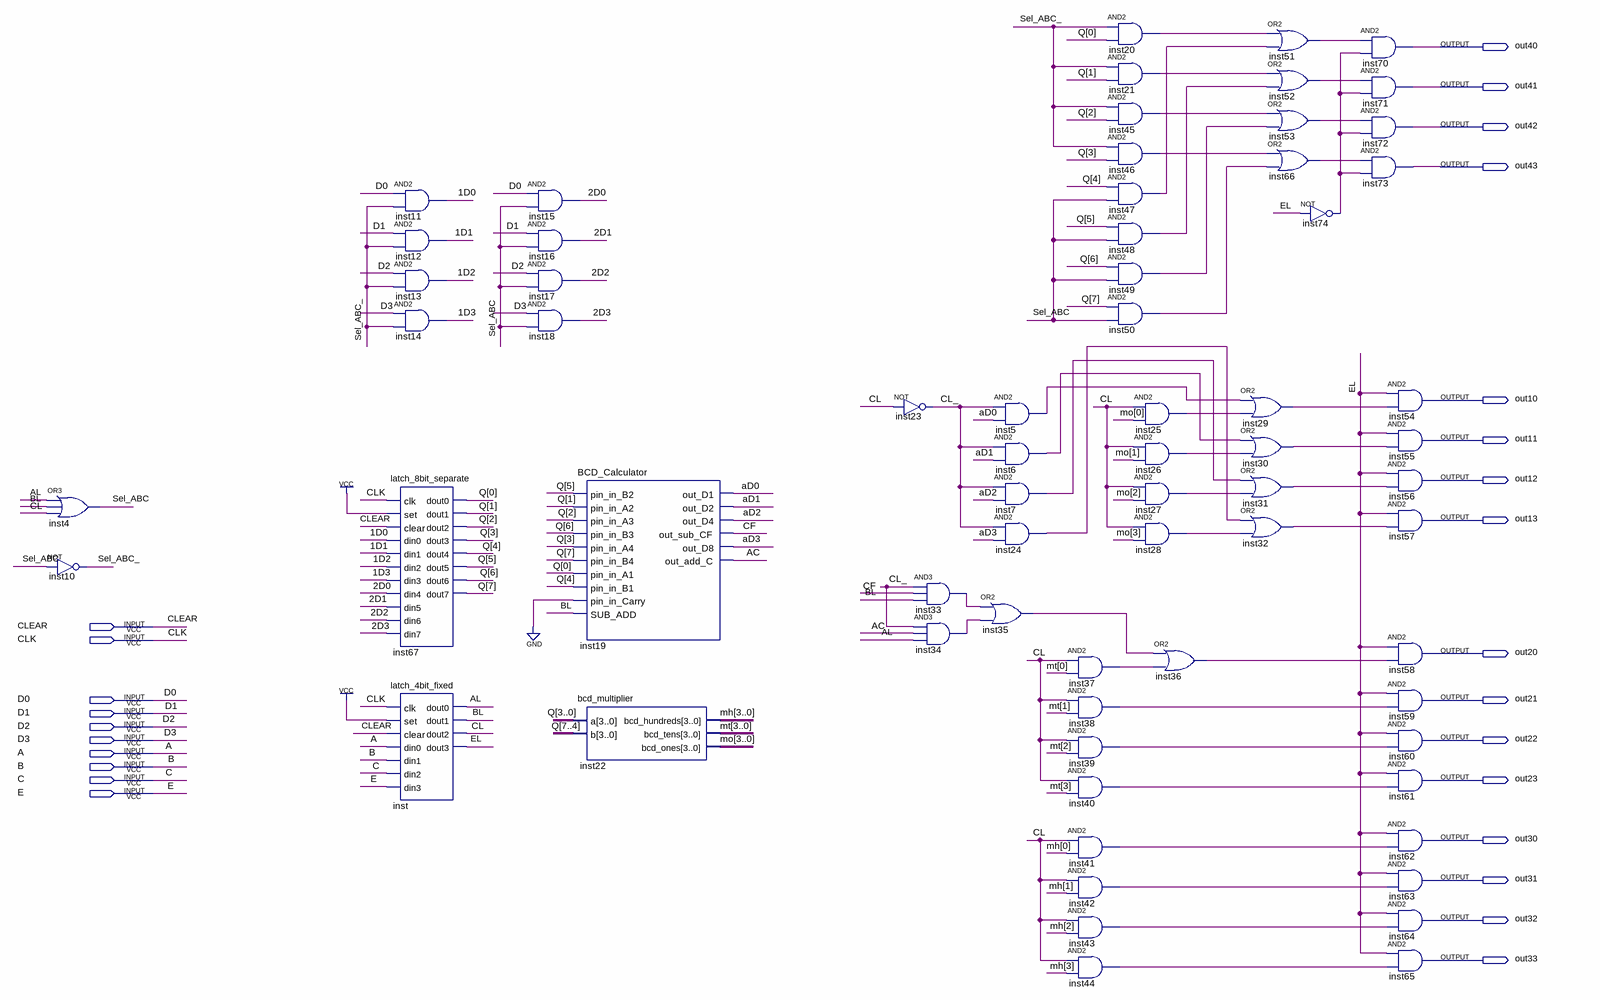
[diagram p0: schematic sheet]
// Quartus schematic Simulation_Circuit.bdf as structural Verilog: 68 symbols, 26 pins
module Simulation_Circuit (
  input  CLEAR,
  input  CLK,
  input  D0,
  input  D1,
  input  D2,
  input  D3,
  input  A,
  input  B,
  input  C,
  input  E,
  output out40,
  output out41,
  output out42,
  output out43,
  output out10,
  output out11,
  output out12,
  output out13,
  output out20,
  output out21,
  output out22,
  output out23,
  output out30,
  output out31,
  output out32,
  output out33
);

  wire \1D0 , \1D1 , \1D2 , \1D3 , \2D0 , \2D1 , \2D2 , \2D3 , AC, aD0, aD1, aD2, aD3, AL, BL, CF, CL, CL_,
       EL, inst5_out, inst6_out, inst7_out, inst20_out, inst21_out, inst24_out, inst25_out, inst26_out,
       inst27_out, inst28_out, inst29_out, inst30_out, inst31_out, inst32_out, inst33_out, inst34_out,
       inst35_out, inst36_out, inst37_out, inst38_out, inst39_out, inst40_out, inst41_out, inst42_out,
       inst43_out, inst44_out, inst45_out, inst46_out, inst47_out, inst48_out, inst49_out, inst50_out,
       inst51_out, inst52_out, inst53_out, inst66_out, inst74_out, Sel_ABC, Sel_ABC_;
  wire [3:0] mh, mo, mt;
  wire [7:0] Q;

  or inst4 (Sel_ABC, AL, BL, CL);
  not inst10 (Sel_ABC_, Sel_ABC);
  latch_8bit_separate inst67 (
    .clk(CLK), .set(1'b1), .clear(CLEAR), .din0(\1D0 ), .din1(\1D1 ), .din2(\1D2 ), .din3(\1D3 ),
    .din4(\2D0 ), .din5(\2D1 ), .din6(\2D2 ), .din7(\2D3 ), .dout0(Q[0]), .dout1(Q[1]), .dout2(Q[2]),
    .dout3(Q[3]), .dout4(Q[4]), .dout5(Q[5]), .dout6(Q[6]), .dout7(Q[7]));
  latch_4bit_fixed inst (
    .clk(CLK), .set(1'b1), .clear(CLEAR), .din0(A), .din1(B), .din2(C), .din3(E), .dout0(AL), .dout1(BL),
    .dout2(CL), .dout3(EL));
  and inst11 (\1D0 , D0, Sel_ABC_);
  and inst12 (\1D1 , D1, Sel_ABC_);
  and inst13 (\1D2 , D2, Sel_ABC_);
  and inst14 (\1D3 , D3, Sel_ABC_);
  and inst15 (\2D0 , D0, Sel_ABC);
  and inst16 (\2D1 , D1, Sel_ABC);
  and inst17 (\2D2 , D2, Sel_ABC);
  and inst18 (\2D3 , D3, Sel_ABC);
  BCD_Calculator inst19 (
    .pin_in_B2(Q[5]), .pin_in_A2(Q[1]), .pin_in_A3(Q[2]), .pin_in_B3(Q[6]), .pin_in_A4(Q[3]),
    .pin_in_B4(Q[7]), .pin_in_A1(Q[0]), .pin_in_B1(Q[4]), .pin_in_Carry(1'b0), .SUB_ADD(BL), .out_D1(aD0),
    .out_D2(aD1), .out_D4(aD2), .out_sub_CF(CF), .out_D8(aD3), .out_add_C(AC));
  bcd_multiplier inst22 (.a(Q[3:0]), .b(Q[7:4]), .bcd_hundreds(mh), .bcd_tens(mt), .bcd_ones(mo));
  not inst23 (CL_, CL);
  and inst33 (inst33_out, CL_, CF, BL);
  and inst34 (inst34_out, CL_, AC, AL);
  and inst5 (inst5_out, CL_, aD0);
  and inst6 (inst6_out, CL_, aD1);
  and inst7 (inst7_out, CL_, aD2);
  and inst24 (inst24_out, CL_, aD3);
  or inst35 (inst35_out, inst33_out, inst34_out);
  and inst37 (inst37_out, CL, mt[0]);
  and inst38 (inst38_out, CL, mt[1]);
  and inst39 (inst39_out, CL, mt[2]);
  and inst40 (inst40_out, CL, mt[3]);
  and inst41 (inst41_out, CL, mh[0]);
  and inst42 (inst42_out, CL, mh[1]);
  and inst43 (inst43_out, CL, mh[2]);
  and inst44 (inst44_out, CL, mh[3]);
  and inst20 (inst20_out, Sel_ABC_, Q[0]);
  and inst21 (inst21_out, Sel_ABC_, Q[1]);
  and inst45 (inst45_out, Sel_ABC_, Q[2]);
  and inst46 (inst46_out, Sel_ABC_, Q[3]);
  and inst47 (inst47_out, Q[4], Sel_ABC);
  and inst48 (inst48_out, Q[5], Sel_ABC);
  and inst49 (inst49_out, Q[6], Sel_ABC);
  and inst50 (inst50_out, Q[7], Sel_ABC);
  and inst25 (inst25_out, CL, mo[0]);
  and inst26 (inst26_out, CL, mo[1]);
  and inst27 (inst27_out, CL, mo[2]);
  and inst28 (inst28_out, CL, mo[3]);
  or inst36 (inst36_out, inst35_out, inst37_out);
  or inst29 (inst29_out, inst5_out, inst25_out);
  or inst30 (inst30_out, inst6_out, inst26_out);
  or inst31 (inst31_out, inst7_out, inst27_out);
  or inst32 (inst32_out, inst24_out, inst28_out);
  or inst51 (inst51_out, inst20_out, inst47_out);
  or inst52 (inst52_out, inst21_out, inst48_out);
  or inst53 (inst53_out, inst45_out, inst49_out);
  or inst66 (inst66_out, inst46_out, inst50_out);
  not inst74 (inst74_out, EL);
  and inst70 (out40, inst51_out, inst74_out);
  and inst71 (out41, inst52_out, inst74_out);
  and inst72 (out42, inst53_out, inst74_out);
  and inst73 (out43, inst66_out, inst74_out);
  and inst54 (out10, EL, inst29_out);
  and inst55 (out11, EL, inst30_out);
  and inst56 (out12, EL, inst31_out);
  and inst57 (out13, EL, inst32_out);
  and inst58 (out20, EL, inst36_out);
  and inst59 (out21, EL, inst38_out);
  and inst60 (out22, EL, inst39_out);
  and inst61 (out23, EL, inst40_out);
  and inst62 (out30, EL, inst41_out);
  and inst63 (out31, EL, inst42_out);
  and inst64 (out32, EL, inst43_out);
  and inst65 (out33, EL, inst44_out);
endmodule
